# EAGLE schematic teemsyUp (EAGLE 9.1.3)
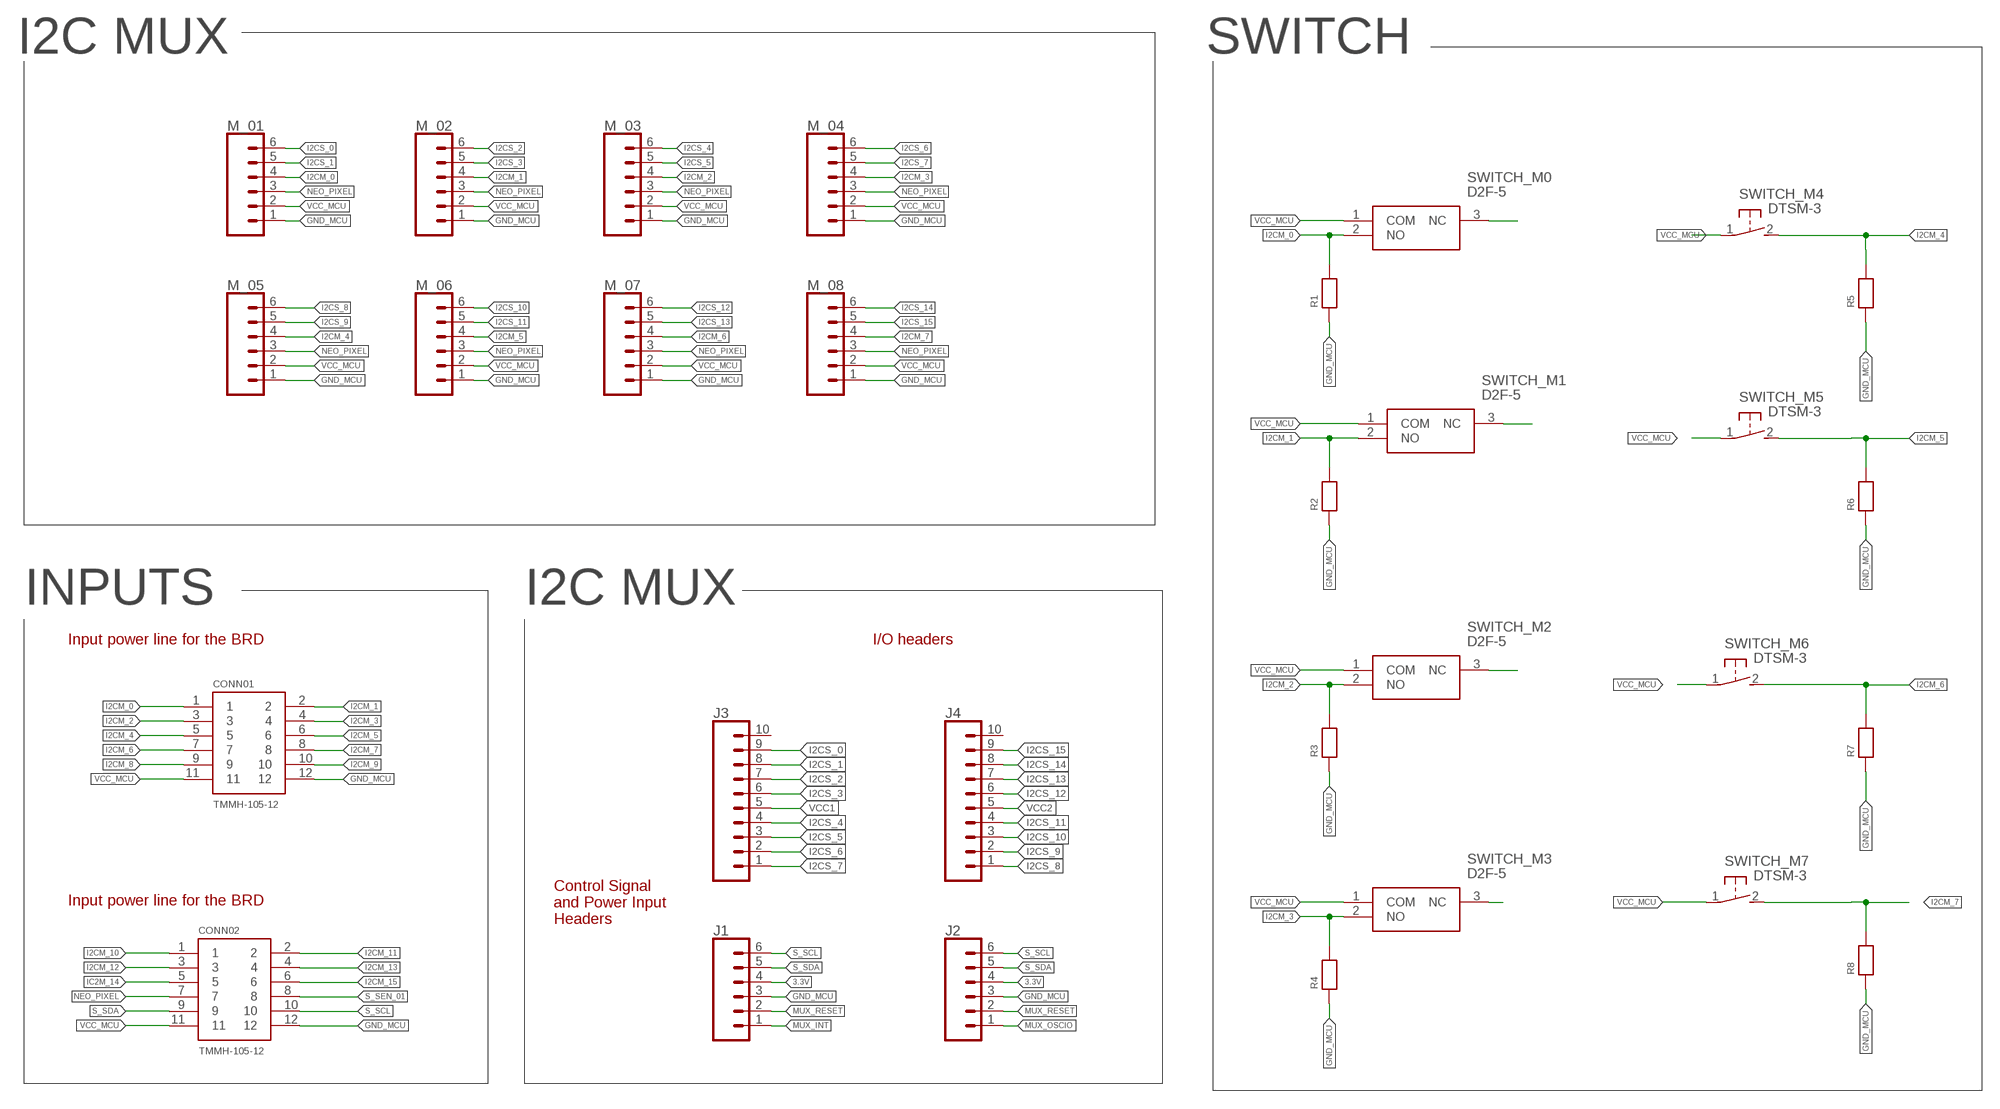
[diagram p0: schematic, sheet 1, part 1 of 2]
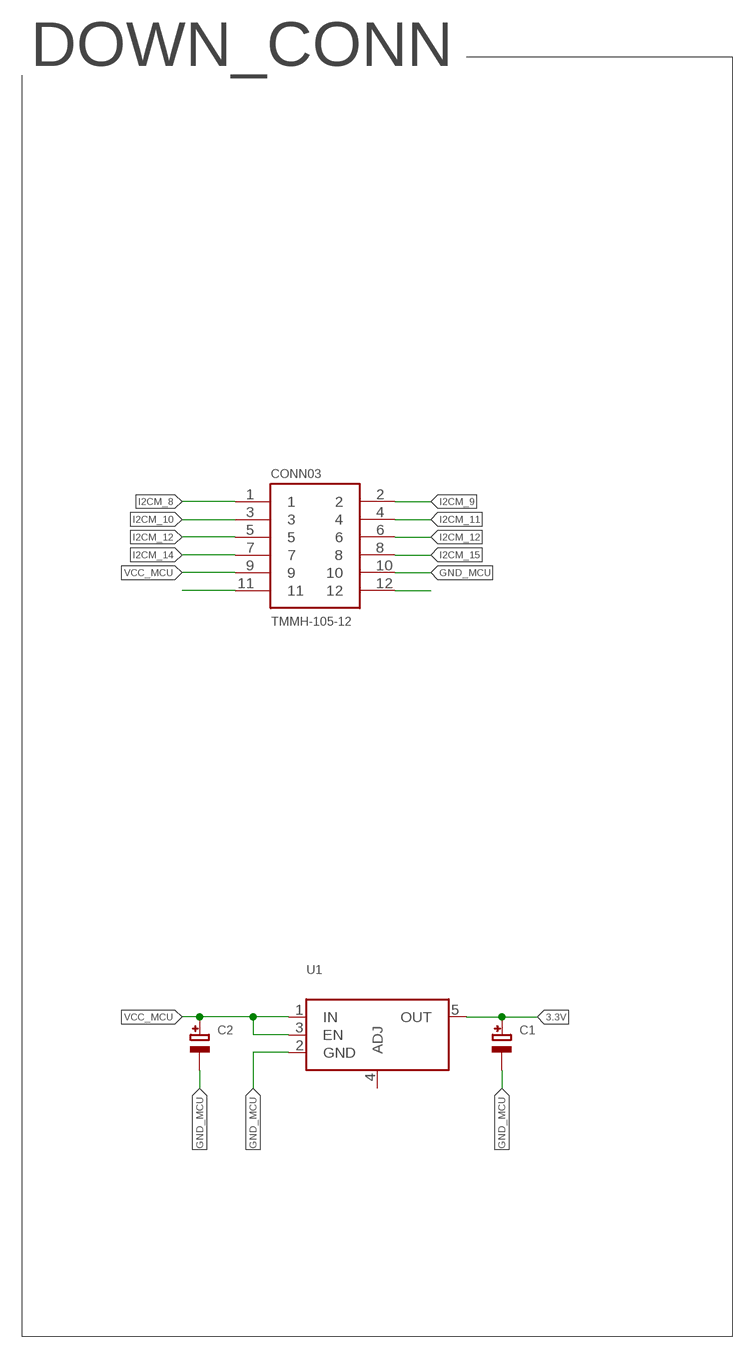
[diagram p1: schematic, sheet 1, part 2 of 2]

## Parts
C1  CAP_TANTALUMA/3216_REFLOW  [EIA3216-18/A-R]
C2  CAP_TANTALUMA/3216_REFLOW  [EIA3216-18/A-R]
CONN01  TMMH-105-12  [TMMH-105-12]
CONN02  TMMH-105-12  [TMMH-105-12]
CONN03  TMMH-105-12  [TMMH-105-12]
J1  CONN_06SMD_MALE  [1X06_SMD_MALE]
J2  CONN_06SMD_MALE  [1X06_SMD_MALE]
J3  CONN_10SMD_MALE  [1X10_SMD_MALE]
J4  CONN_10SMD_MALE  [1X10_SMD_MALE]
M_01  CONN_06SMD-1MM  [1X06-1MM]
M_02  CONN_06SMD-1MM  [1X06-1MM]
M_03  CONN_06SMD-1MM  [1X06-1MM]
M_04  CONN_06SMD-1MM  [1X06-1MM]
M_05  CONN_06SMD-1MM  [1X06-1MM]
M_06  CONN_06SMD-1MM  [1X06-1MM]
M_07  CONN_06SMD-1MM  [1X06-1MM]
M_08  CONN_06SMD-1MM  [1X06-1MM]
R1  RESISTOR1206  [1206]
R2  RESISTOR1206  [1206]
R3  RESISTOR1206  [1206]
R4  RESISTOR1206  [1206]
R5  RESISTOR1206  [1206]
R6  RESISTOR1206  [1206]
R7  RESISTOR1206  [1206]
R8  RESISTOR1206  [1206]
SWITCH_M0  D2F-5  [SHDR3W100P0X508_1X3_1280X580X5]
SWITCH_M1  D2F-5  [SHDR3W100P0X508_1X3_1280X580X5]
SWITCH_M2  D2F-5  [SHDR3W100P0X508_1X3_1280X580X5]
SWITCH_M3  D2F-5  [SHDR3W100P0X508_1X3_1280X580X5]
SWITCH_M4  DTSM-3  [DTSM-3]
SWITCH_M5  DTSM-3  [DTSM-3]
SWITCH_M6  DTSM-3  [DTSM-3]
SWITCH_M7  DTSM-3  [DTSM-3]
U1  ADP1712  [SOT23-5]

## Nets
3.3V: C1.+ J1.4 J2.4 U1.5(OUT)
GND_MCU: C1.- C2.- CONN01.12 CONN02.12 CONN03.10 J1.3 J2.3 M_01.1 M_02.1 M_03.1 M_04.1 M_05.1 M_06.1 M_07.1 M_08.1 R1.1 R2.1 R3.1 R4.1 R5.1 R6.1 R7.1 R8.1 U1.2(GND)
I2CM_0: CONN01.1 M_01.4 R1.2 SWITCH_M0.2(NO)
I2CM_1: CONN01.2 M_02.4 R2.2 SWITCH_M1.2(NO)
I2CM_2: CONN01.3 M_03.4 R3.2 SWITCH_M2.2(NO)
I2CM_3: CONN01.4 M_04.4 R4.2 SWITCH_M3.2(NO)
I2CM_4: CONN01.5 M_05.4 R5.2 SWITCH_M4.2
I2CM_5: CONN01.6 M_06.4 R6.2 SWITCH_M5.2
I2CM_6: CONN01.7 M_07.4 R7.2 SWITCH_M6.2
I2CM_7: CONN01.8 M_08.4 R8.2 SWITCH_M7.2
I2CM_8: CONN01.9 CONN03.1
I2CM_9: CONN01.10 CONN03.2
I2CM_10: CONN02.1 CONN03.3
I2CM_11: CONN02.2 CONN03.4
I2CM_12: CONN02.3 CONN03.5 CONN03.6
I2CM_13: CONN02.4
I2CM_14: CONN03.7
I2CM_15: CONN02.6 CONN03.8
I2CS_0: J3.9 M_01.6
I2CS_1: J3.8 M_01.5
I2CS_2: J3.7 M_02.6
I2CS_3: J3.6 M_02.5
I2CS_4: J3.4 M_03.6
I2CS_5: J3.3 M_03.5
I2CS_6: J3.2 M_04.6
I2CS_7: J3.1 M_04.5
I2CS_8: J4.1 M_05.6
I2CS_9: J4.2 M_05.5
I2CS_10: J4.3 M_06.6
I2CS_11: J4.4 M_06.5
I2CS_12: J4.6 M_07.6
I2CS_13: J4.7 M_07.5
I2CS_14: J4.8 M_08.6
I2CS_15: J4.9 M_08.5
IC2M_14: CONN02.5
MUX_INT: J1.1
MUX_OSCIO: J2.1
MUX_RESET: J1.2 J2.2
N$12: CONN03.11
N$16: SWITCH_M3.3(NC)
N$17: SWITCH_M2.3(NC)
N$18: SWITCH_M1.3(NC)
N$19: SWITCH_M0.3(NC)
N$22: CONN03.12
NEO_PIXEL: CONN02.7 M_01.3 M_02.3 M_03.3 M_04.3 M_05.3 M_06.3 M_07.3 M_08.3
S_SCL: CONN02.10 J1.6 J2.6
S_SDA: CONN02.9 J1.5 J2.5
S_SEN_01: CONN02.8
VCC1: J3.5
VCC2: J4.5
VCC_MCU: C2.+ CONN01.11 CONN02.11 CONN03.9 M_01.2 M_02.2 M_03.2 M_04.2 M_05.2 M_06.2 M_07.2 M_08.2 SWITCH_M0.1(COM) SWITCH_M1.1(COM) SWITCH_M2.1(COM) SWITCH_M3.1(COM) SWITCH_M4.1 SWITCH_M5.1 SWITCH_M6.1 SWITCH_M7.1 U1.1(IN) U1.3(EN)
Unconnected: J3.10 J4.10 U1.4(ADJ)

## Notes on the sheet
- I2C MUX | SWITCH | DOWN_CONN
- INPUTS | I2C MUX
- Input power line for the BRD | I/O headers
- Control Signal
  and Power Input
  Headers
- Input power line for the BRD

## Library data of the parts
C1 C2 = microbuilder:CAP_TANTALUM: Tantalum Capacitors Wave footprints have larger pads and are meant to be used for hand soldering. Reflow footprints are optimised for solder paste and a reflow oven. EIA3216-18/A-[R/W] - Size A / 3216-18 / 1206 footprint 4.7µF 25V 10% Tantalum Capacitor 10µF 16V 10% Tantalum Capacitor [Digikey: 495-2236-2-ND] EIA3528-21/B-[R/W] - Size B / 3528-21 47µF 10V 10% Tantalum Capactior [Digikey: 495-2216-1-ND] EIA6032-28/C-[R/W] - Size C / 6032-28 10µF 35V 20% Tantalum Capacitor [Digikey: 495-2285-1-ND] 100µF 16V 10% Tantalum Capactior [Digikey: 399-5214-1-ND]
CONN01-CONN03 = TMMH-105-XX-XX-DV:TMMH-105-12: 2mm (.0787") Flex Shroud, .020" (.51mm) Square Post Terminal Strip, Surface Mount,10 Pins.
J1 J2 = SparkFun-Connectors:CONN_06: Multi connection point. Often used as Generic Header-pin footprint for 0.1 inch spaced/style header connections On any of the 0.1 inch spaced packages, you can populate with these: Break Away Headers - Straight <https://www.sparkfun.com/products/116> (PRT-00116) Break Away Male Headers - Right Angle <https://www.sparkfun.com/products/553> (PRT-00553) Female Headers <https://www.sparkfun.com/products/115> (PRT-00115) Break Away Headers - Machine Pin <https://www.sparkfun.com/products/117> (PRT-00117) Break Away Female Headers - Swiss Machine Pin <https://www.sparkfun.com/products/743> (PRT-00743) Arduino Stackable Header - 6 Pin <https://www.sparkfun.com/products/9280> (PRT-09280) For SCREWTERMINALS and SPRING TERMINALS visit here: Screw Terimnals on SparkFun.com <https://www.sparkfun.com/search/results?term=Screw+Terminals> (5mm/3.5mm/2.54mm spacing) This device is also useful as a general connection point to wire up your design to another part of your project. Our various solder wires solder well into these plated through hole pads. Hook-Up Wire - Assortment (Stranded, 22 AWG) <https://www.sparkfun.com/products/11375> (PRT-11375) Hook-Up Wire - Assortment (Solid Core, 22 AWG) <https://www.sparkfun.com/products/11367> (PRT-11367) View the entire wire category on our website here <https://www.sparkfun.com/categories/141>; PROD_ID: CONN-11293
J3 J4 = SparkFun-Connectors:CONN_10: Multi connection point. Often used as Generic Header-pin footprint for 0.1 inch spaced/style header connections On any of the 0.1 inch spaced packages, you can populate with these: Break Away Headers - Straight <https://www.sparkfun.com/products/116> (PRT-00116) Break Away Male Headers - Right Angle <https://www.sparkfun.com/products/553> (PRT-00553) Female Headers <https://www.sparkfun.com/products/115> (PRT-00115) Break Away Headers - Machine Pin <https://www.sparkfun.com/products/117> (PRT-00117) Break Away Female Headers - Swiss Machine Pin <https://www.sparkfun.com/products/743> (PRT-00743) Arduino Stackable Header - 10 Pin <https://www.sparkfun.com/products/11376> (PRT-11376) For SCREWTERMINALS and SPRING TERMINALS visit here: Screw Terimnals on SparkFun.com <https://www.sparkfun.com/search/results?term=Screw+Terminals> (5mm/3.5mm/2.54mm spacing) This device is also useful as a general connection point to wire up your design to another part of your project. Our various solder wires solder well into these plated through hole pads. Hook-Up Wire - Assortment (Stranded, 22 AWG) <https://www.sparkfun.com/products/11375> (PRT-11375) Hook-Up Wire - Assortment (Solid Core, 22 AWG) <https://www.sparkfun.com/products/11367> (PRT-11367) View the entire wire category on our website here <https://www.sparkfun.com/categories/141> Special notes: Molex polarized connector foot print use with SKU : PRT-08231 with associated crimp pins and housings. 1MM SMD Version SKU: PRT-10208 NOTES ON THE VARIANTS LOCK and LOCK_LONGPADS... This footprint was designed to help hold the alignment of a through-hole component (i.e. 6-pin header) while soldering it into place. You may notice that each hole has been shifted either up or down by 0.005 of an inch from it's more standard position (which is a perfectly straight line). This slight alteration caused the pins (the squares in the middle) to touch the edges of the holes. Because they are alternating, it causes a "brace" to hold the component in place. 0.005 has proven to be the perfect amount of "off-center" position when using our standard breakaway headers. Although looks a little odd when you look at the bare footprint, once you have a header in there, the alteration is very hard to notice. Also,if you push a header all the way into place, it is covered up entirely on the bottom side.; PROD_ID: CONN-11291
M_01-M_08 = SparkFun-Connectors:CONN_06: Multi connection point. Often used as Generic Header-pin footprint for 0.1 inch spaced/style header connections On any of the 0.1 inch spaced packages, you can populate with these: Break Away Headers - Straight <https://www.sparkfun.com/products/116> (PRT-00116) Break Away Male Headers - Right Angle <https://www.sparkfun.com/products/553> (PRT-00553) Female Headers <https://www.sparkfun.com/products/115> (PRT-00115) Break Away Headers - Machine Pin <https://www.sparkfun.com/products/117> (PRT-00117) Break Away Female Headers - Swiss Machine Pin <https://www.sparkfun.com/products/743> (PRT-00743) Arduino Stackable Header - 6 Pin <https://www.sparkfun.com/products/9280> (PRT-09280) For SCREWTERMINALS and SPRING TERMINALS visit here: Screw Terimnals on SparkFun.com <https://www.sparkfun.com/search/results?term=Screw+Terminals> (5mm/3.5mm/2.54mm spacing) This device is also useful as a general connection point to wire up your design to another part of your project. Our various solder wires solder well into these plated through hole pads. Hook-Up Wire - Assortment (Stranded, 22 AWG) <https://www.sparkfun.com/products/11375> (PRT-11375) Hook-Up Wire - Assortment (Solid Core, 22 AWG) <https://www.sparkfun.com/products/11367> (PRT-11367) View the entire wire category on our website here <https://www.sparkfun.com/categories/141>; PROD_ID: CONN-08249; SF_ID: GPS-00579
R1-R8 = microbuilder:RESISTOR: Resistors 0402 - 0402 Surface Mount Package 22 Ohm 1% 1/16W [Digikey: 311-22.0LRTR-ND] 33 Ohm 5% 1/16W 1.0K 5% 1/16W 1.5K 5% 1/16W 2.0K 1% 1/16W 10.0K 1% 1/16W [Digikey: 311-10.0KLRTR-ND] 10.0K 5% 1/16W [Digikey: RMCF0402JT10K0TR-ND] 12.1K 1% 1/16W [Digikey: 311-22.0LRTR-ND] 100.0K 5% 1/16W 0603 - 0603 Surface Mount Package 0 Ohm 1/10 Watt 1% Resistor 15 Ohm 1/10 Watt 1% Resistor 33 Ohm 1/10 Watt 1% Resistor 49.9 Ohm 1/10 Watt 1% Resistor 100 Ohm 1/10 Watt 1% Resistor 150 Ohm 1/10 Watt 1% Resistor 240 Ohm 1/10 Watt 1% Resistor 390 Ohm 1/10 Watt 1% Resistor 560 Ohm 1/10 Watt 1% Resistor 680 Ohm 1/10 Watt 1% Resistor 750 Ohm 1/10 Watt 1% Resistor 1.0K Ohm 1/10 Watt 1% Resistor 1.5K Ohm 1/10 Watt 1% Resistor 2.0K Ohm 1/10 Watt 1% Resistor 2.2K Ohm 1/10 Watt 1% Resistor 3.3K Ohm 1/10 Watt 1% Resistor 4.7K Ohm 1/10 Watt 1% Resistor 10.0K Ohm 1/10 Watt 1% Resistor 12.0K Ohm 1/10 Watt 1% Resistor 12.1K Ohm 1/10 Watt 1% Resistor 20.0K Ohm 1/10 Watt 1% Resistor 33.0K Ohm 1/10 Watt 1% Resistor 100.0K Ohm 1/10 Watt 1% Resistor 0805 - 0805 Surface Mount Package 0 Ohm 1/8 Watt 1% Resistor 33 Ohm 1/8 Watt 1% Resistor 100 Ohm 1/8 Watt 1% Resistor 150 Ohm 1/8 Watt 1% Resistor 200 Ohm 1/8 Watt 1% Resistor 240 Ohm 1/8 Watt 1% Resistor 330 Ohm 1/8 Watt 1% Resistor 390 Ohm 1/8 Watt 1% Resistor 470 Ohm 1/8 Watt 1% Resistor 1.0K Ohm 1/8 Watt 1% Resistor 1.5K Ohm 1/8 Watt 1% Resistor 2.0K Ohm 1/8 Watt 1% Resistor 4.7K Ohm 1/8 Watt 1% Resistor 5.1K Ohm 1/8 Watt 1% Resistor 5.6K Ohm 1/8 Watt 1% Resistor 10.0K Ohm 1/8 Watt 1% Resistor 22.0K Ohm 1/8 Watt 1% Resistor 33.0K Ohm 1/8 Watt 1% Resistor 100K Ohm 1/8 Watt 1% Resistor 1206 - 1206 Surface Mount Package 2012 - 2010 Surface Mount Package 0.11 Ohm 1/2 Watt 1% Resistor - Digikey: RHM.11UCT-ND
SWITCH_M0 SWITCH_M1-SWITCH_M3 = D2F-5:D2F-5: OMRON ELECTRONIC COMPONENTS - D2F-5 - MICROSWITCH, PLUNGER, SPDT, 5A, 250V, TH Source: Datasheet <http://omronfs.omron.com/en_US/ecb/products/pdf/en-d2f.pdf>; ALLIED_NUMBER: 71203873; ALLIED_PRICE-STOCK: https://www.alliedelec.com/omron-electronic-components-d2f-5/71203873/; DESCRIPTION: OMRON ELECTRONIC COMPONENTS - D2F-5 - MICROSWITCH, PLUNGER, SPDT, 5A, 250V, TH; HEIGHT: 5.8mm; MANUFACTURER_NAME: Omron Electronics; MANUFACTURER_PART_NUMBER: D2F-5; MOUSER_PART_NUMBER: 653-D2F-5; MOUSER_PRICE-STOCK: https://www.mouser.com/Search/Refine.aspx?Keyword=653-D2F-5
SWITCH_M4-SWITCH_M7 = switch-tact:DTSM-3
U1 = microbuilder:ADP1712: LDO Adj. Voltage Regulator 300mA The ADP1712 voltage regulator is ideal for regulating battery or solar power due to it's very low foreward voltage drop (maximum 170mV at 300mA). Forward Voltage Dropout: 170mV at 300mA Input Voltage Range: 2.5V-5.5V Output Voltage Range: 0.8V-5.0V 1.2V - Digikey: ADP1712AUJZ-1.2-R7CT-ND 1.8V - Digikey: ADP1712AUJZ-1.8-R7CT-ND 3.3V - Digikey: ADP1712AUJZ-3.3-R7CT-ND